# EAGLE design operator-interface-usb-to-xbee-r1 (EAGLE 5.12)
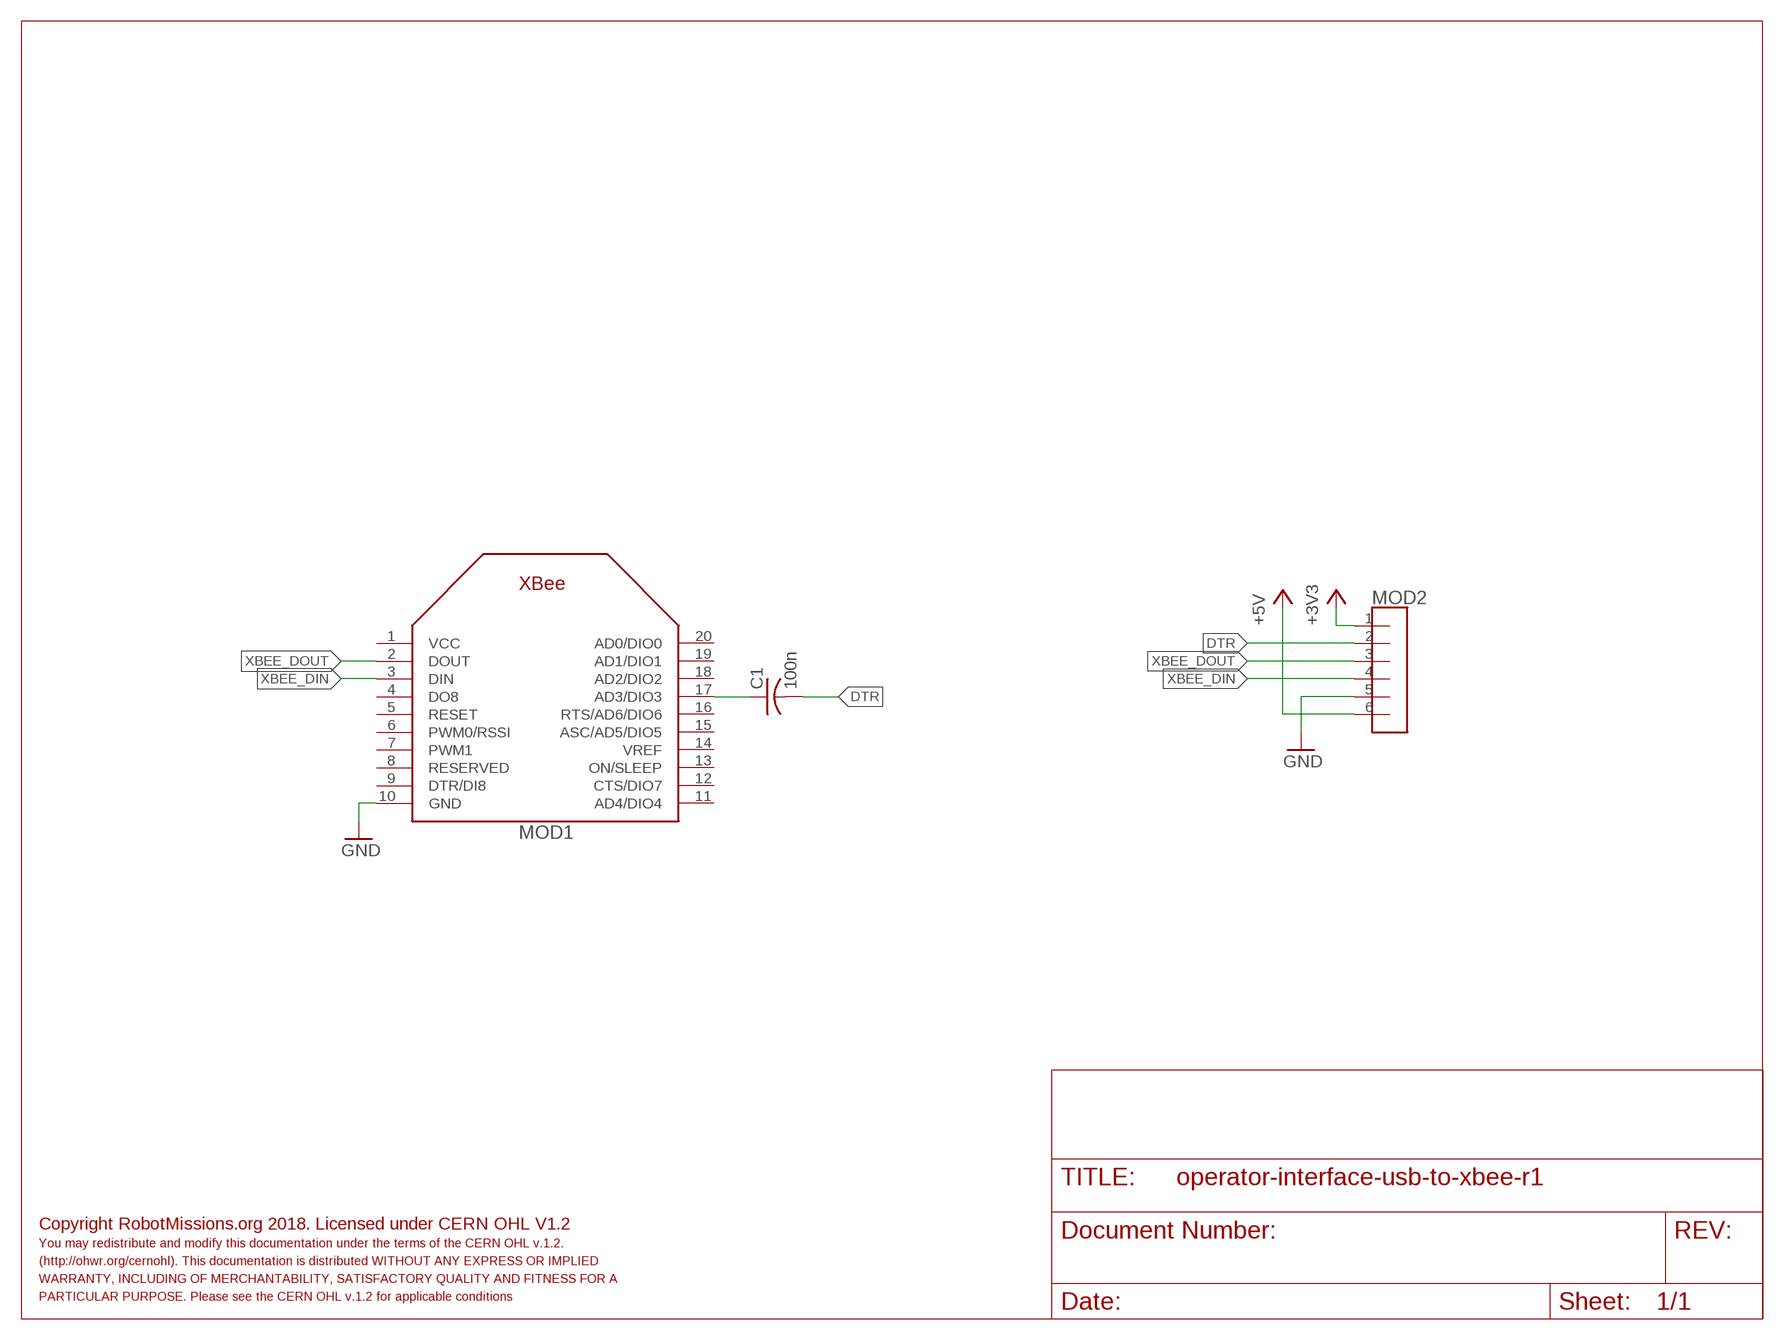
[diagram p0: schematic, sheet 1]

## Parts
C1  100n  C-US025-025X050  [C025-025X050]
MOD1  XBEE  [XBEE]
MOD2  M06-100MIL  [100MIL-6]

## Nets
+3V3: MOD2.1
+5V: MOD2.6
DTR: C1.2 MOD2.2
GND: MOD1.10(GND) MOD2.5
N$5: C1.1 MOD1.17(AD3/DIO3)
XBEE_DIN: MOD1.3(DIN) MOD2.4
XBEE_DOUT: MOD1.2(DOUT) MOD2.3
Unconnected: MOD1.1(VCC) MOD1.4(DO8) MOD1.5(RESET) MOD1.6(PWM0/RSSI) MOD1.7(PWM1) MOD1.8(RESERVED) MOD1.9(DTR/DI8) MOD1.11(AD4/DIO4) MOD1.12(CTS/DIO7) MOD1.13(ON/SLEEP) MOD1.14(VREF) MOD1.15(ASC/AD5/DIO5) MOD1.16(RTS/AD6/DIO6) MOD1.18(AD2/DIO2) MOD1.19(AD1/DIO1) MOD1.20(AD0/DIO0)

## Notes on the sheet
- Copyright RobotMissions.org 2018. Licensed under CERN OHL V1.2
- You may redistribute and modify this documentation under the terms of the CERN OHL v.1.2.
- (http://ohwr.org/cernohl). This documentation is distributed WITHOUT ANY EXPRESS OR IMPLIED
- WARRANTY, INCLUDING OF MERCHANTABILITY, SATISFACTORY QUALITY AND FITNESS FOR A
- PARTICULAR PURPOSE. Please see the CERN OHL v.1.2 for applicable conditions

## Library data of the parts
C1 = rcl:C-US: CAPACITOR, American symbol
MOD1 = adafruit:XBEE
MOD2 = rbg-generic-headers:M06-100MIL

## Board
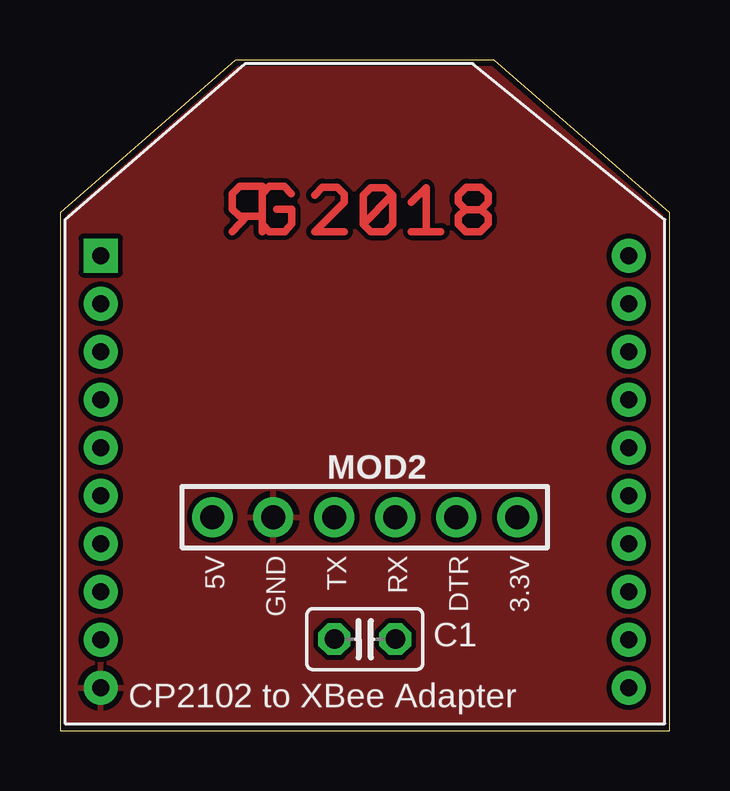
[diagram p1: board, top side]
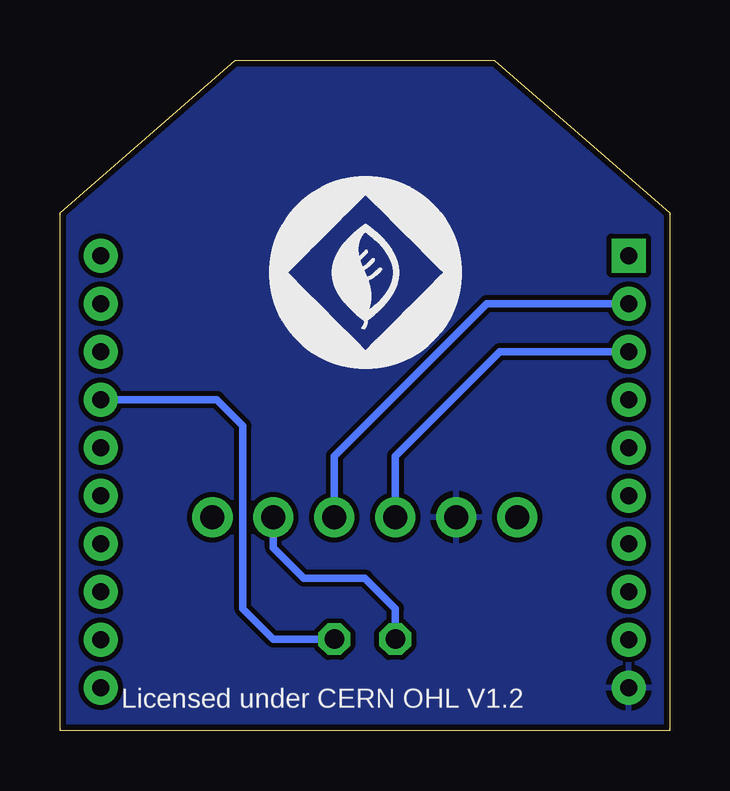
[diagram p2: board, bottom side, seen from below]

Size 25.4 x 27.94 mm. Coordinates in mm from the lower left corner, seen from the top.
Outline: 0,0 25.4,0 25.4,21.58 18.1,27.94 7.3,27.94 0,21.58 0,0
Copper layers (1*16): Top 0.035mm / dielectric 1.5mm / Bottom 0.035mm
Design rules "default *": minimum track width 8mil, minimum drill 0.5mm, track to track 8mil, track to pad 8mil, pad to pad 8mil, via to via 8mil, smd to smd 8mil, copper to edge 10mil, drill to drill 8mil, minimum pad ring 10mil, minimum via ring 8mil, stop-mask expansion 4mil, vias tented up to drill 0mil, thermal gap 10mil

### Footprints (pad centres in the part's own frame; a part is rotated, then mirrored left to right if it is on the bottom)
C025-025X050 = drill 0.813 octagon: 1 -1.27,0; 2 1.27,0
XBEE = drill 0.7 pad 1.422 square: 1 -11,5.5 | drill 0.7 pad 1.422 round: 2 -11,3.5; 3 -11,1.5; 4 -11,-0.5; 5 -11,-2.5; 6 -11,-4.5; 7 -11,-6.5; 8 -11,-8.5; 9 -11,-10.5; 10 -11,-12.5; 11 11,-12.5; 12 11,-10.5; 13 11,-8.5; 14 11,-6.5; 15 11,-4.5; 16 11,-2.5; 17 11,-0.5; 18 11,1.5; 19 11,3.5; 20 11,5.5
100MIL-6 = drill 1 pad 1.676 round: 1 -6.35,0; 2 -3.81,0; 3 -1.27,0; 4 1.27,0; 5 3.81,0; 6 6.35,0

### Placement (x,y rotation side)
C1  12.7,3.81 180 top
MOD1  12.7,14.29 0 top
MOD2  12.7,8.89 180 top
U$1  [OSHW_FILLX150_NOTEXT]  10.48,12.7 0 top
U$2  [RGLOGO_SMALL_2018]  8.57,20.64 0 top
U$3  [ROBOT-MISSIONS-LEAF-ONLY]  12.7,19.05 0 bottom

### Tracks (layer width: path | path; a pad name or v marks a point on that pad's centre or on a via)
DTR
  Bottom 0.305: C1.2 11.43,5.08 12.7,6.35 15.24,6.35 16.51,7.62 MOD2.2
GND
  pour Bottom: -1.27,-0.95 26.67,-0.95 26.67,28.26 -1.27,28.26
  pour Top: -1.27,-0.95 26.67,-0.95 26.67,28.26 -1.27,28.26
N$5
  Bottom 0.305: MOD1.17 18.87,13.79 17.78,12.7 17.78,5.08 16.51,3.81 C1.1
XBEE_DIN
  Bottom 0.305: MOD1.3 7.07,15.79 11.43,11.43 MOD2.4
XBEE_DOUT
  Bottom 0.305: MOD1.2 7.61,17.79 13.97,11.43 MOD2.3

### Text on the board
tNames: 5V | GND | TX | RX | DTR | 3.3V | CP2102 to XBee Adapter
bNames: Licensed under CERN OHL V1.2